# Altium schematic sheet IF2.SchDoc
size A4
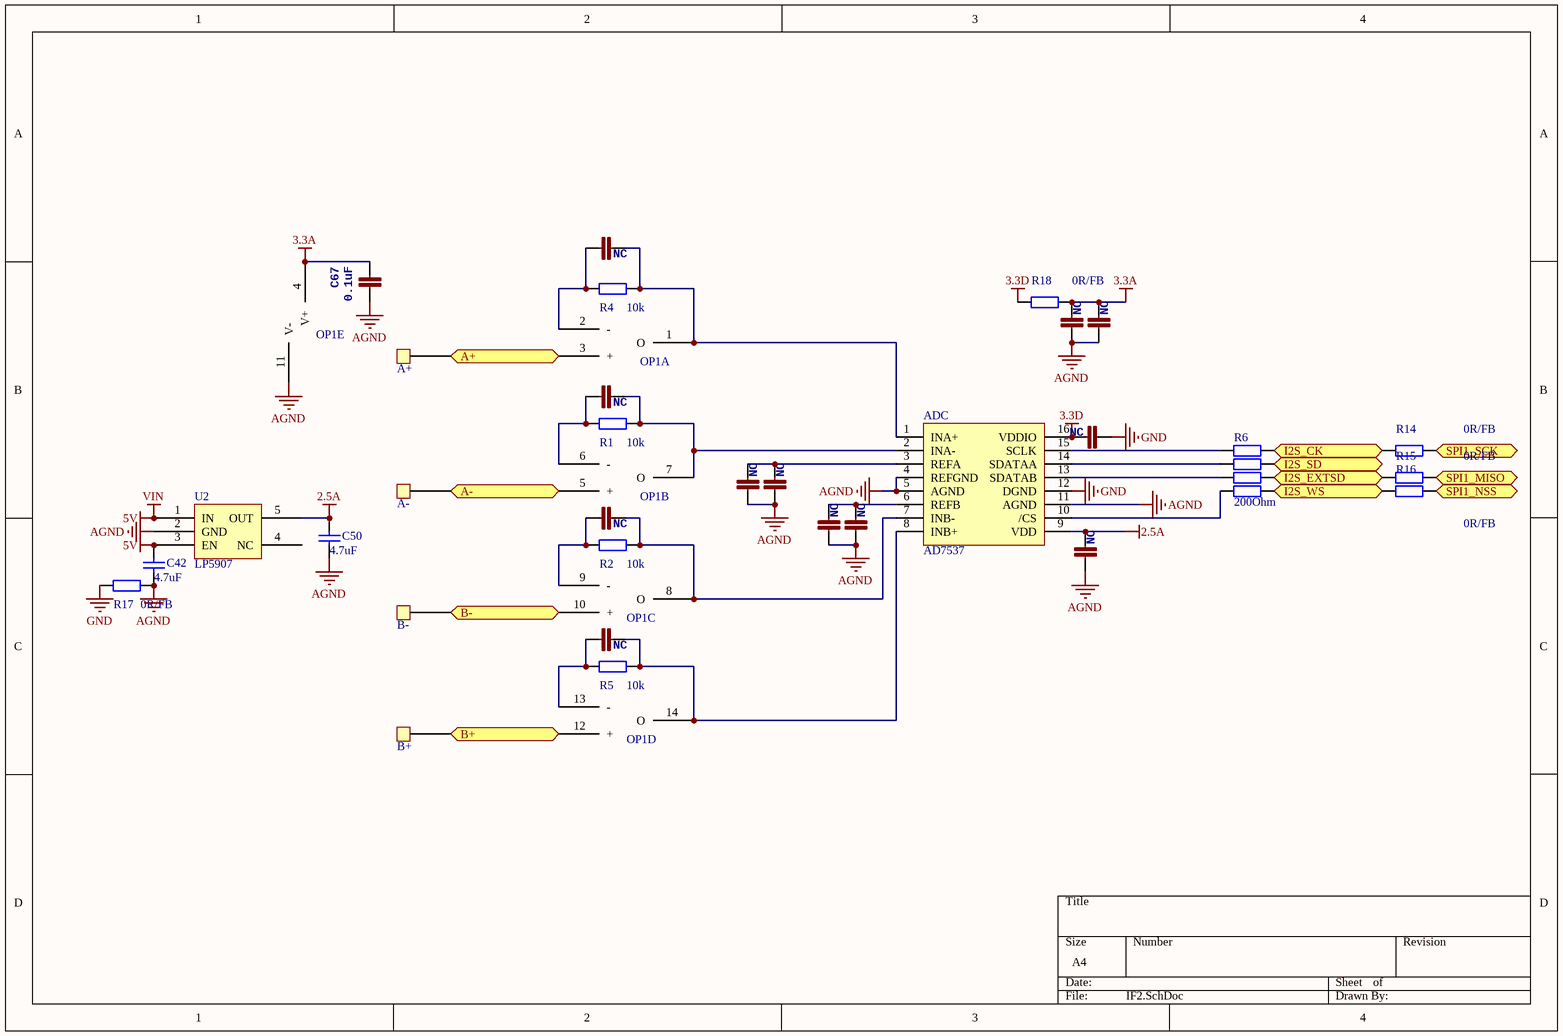
[diagram p0: IF2.SchDoc]

## Parts
A+  TestPad  [TestPad - 1mm]  (value not drawn)
A-  TestPad  [TestPad - 1mm]  (value not drawn)
ADC  AD7537  [AD7357]
B+  TestPad  [TestPad - 1mm]  (value not drawn)
B-  TestPad  [TestPad - 1mm]  (value not drawn)
C1  NC  [0402]
C8  NC  [0402]
C9  NC  [0603]
C12  NC  [0805]
C13  NC  [0402]
C14  NC  [0603]
C15  NC  [0805]
C16  NC  [0402]
C29  NC  [0402]
C30  NC  [0603]
C31  NC  [0603]
C32  NC  [0805]
C42  4.7uF  [0603]
C50  4.7uF  [0603]
C67  0.1uF  [0402]
OP1  MCP6024  (value not drawn)  (parts A,B,C,D,E of 5)
R1  10k  [0402]
R2  10k  [0402]
R4  10k  [0402]
R5  10k  [0402]
R6  value 200Ohm  [0402X4]  (hidden comment: Res*4)
R14  0R/FB  [0402]
R15  0R/FB  [0402]
R16  0R/FB  [0402]
R17  0R/FB  [0402]
R18  0R/FB  [0402]
U2  LP5907  [SOT23-5]

## Ports
A+, A-, B+, B-, I2S_CK, I2S_EXTSD, I2S_SD, I2S_WS, SPI1_MISO, SPI1_NSS, SPI1_SCK

## Nets
2.5A: ADC.9(VDD) C30.1 C50.2 U2.5(OUT)
3.3A: C14.1 C15.1 C67.1 OP1.4(V+) R18.1
3.3D: ADC.16(VDDIO) C29.1 R18.2
5V: C42.2 U2.1(IN) U2.3(EN)  [also labelled VIN]
AGND: ADC.4(REFGND) ADC.5(AGND) ADC.11(AGND) C9.2 C12.2 C14.2 C15.2 C30.2 C31.2 C32.2 C42.1 C50.1 C67.2 OP1.11(V-) R17.1 U2.2(GND)
GND: ADC.12(DGND) C29.2 R17.2
A+: A+.1 OP1.3(+) ; port A+
A-: A-.1 OP1.5(+) ; port A-
B+: B+.1 OP1.12(+) ; port B+
B-: B-.1 OP1.10(+) ; port B-
I2S_CK: R6.4 R14.2 ; port I2S_CK
I2S_EXTSD: R6.2 R15.2 ; port I2S_EXTSD
I2S_SD: R6.3 ; port I2S_SD
I2S_WS: R6.1 R16.2 ; port I2S_WS
SPI1_MISO: R15.1 ; port SPI1_MISO
SPI1_NSS: R16.1 ; port SPI1_NSS
SPI1_SCK: R14.1 ; port SPI1_SCK
NetADC_1: ADC.1(INA+) C1.1 OP1.1(O) R4.1
NetADC_2: ADC.2(INA-) C8.1 OP1.7(O) R1.1
NetADC_3: ADC.3(REFA) C9.1 C12.1
NetADC_6: ADC.6(REFB) C31.1 C32.1
NetADC_7: ADC.7(INB-) C13.1 OP1.8(O) R2.1
NetADC_8: ADC.8(INB+) C16.1 OP1.14(O) R5.1
NetADC_10: ADC.10(/CS) R6.8
NetADC_13: ADC.13(SDATAB) R6.7
NetADC_14: ADC.14(SDATAA) R6.6
NetADC_15: ADC.15(SCLK) R6.5
NetC1_2: C1.2 OP1.2(-) R4.2
NetC8_2: C8.2 OP1.6(-) R1.2
NetC13_2: C13.2 OP1.9(-) R2.2
NetC16_2: C16.2 OP1.13(-) R5.2

Not connected (* = marked no-connect by the designer): U2 4(NC)

## Library data of the parts
C1 C8 C9 C12-C16 C29-C32 C67 = CAP0402-CAP: <b>Capacitor</b> / Standard 0603 ceramic capacitor, and 0.1" leaded capacitor.; PARTNO: CC0402ZRY5V7BB104
C42 C50 = Cap: Capacitor; Published: 8-Jun-2000; LatestRevisionDate: 17-Jul-2002; LatestRevisionNote: Re-released for DXP Platform.; PackageReference: RAD-0.3; Publisher: Altium Limited; PackageDescription: Radial Cap, Thru-Hole; 2 Leads; 0.3 in Pin Spacing
OP1 = OP-SOP14
R1 R2 R4 R5 R14-R18 = Res2: Resistor; Value: 0Ohm; Published: 8-Jun-2000; LatestRevisionDate: 17-Jul-2002; LatestRevisionNote: Re-released for DXP Platform.; PackageReference: AXIAL-0.4; Publisher: Altium Limited; PackageDescription: Axial Device, Thru-Hole; 2 Leads; 0.4 in Pin Spacing
R6 = Res*4: Resistor; Published: 8-Jun-2000; LatestRevisionDate: 17-Jul-2002; LatestRevisionNote: Re-released for DXP Platform.; PackageReference: AXIAL-0.4; Publisher: Altium Limited; PackageDescription: Axial Device, Thru-Hole; 2 Leads; 0.4 in Pin Spacing